# Altium schematic sheet SOM_Console.SchDoc
size 420 x 297 mm; SheetNumber: 9; SheetTotal: 21
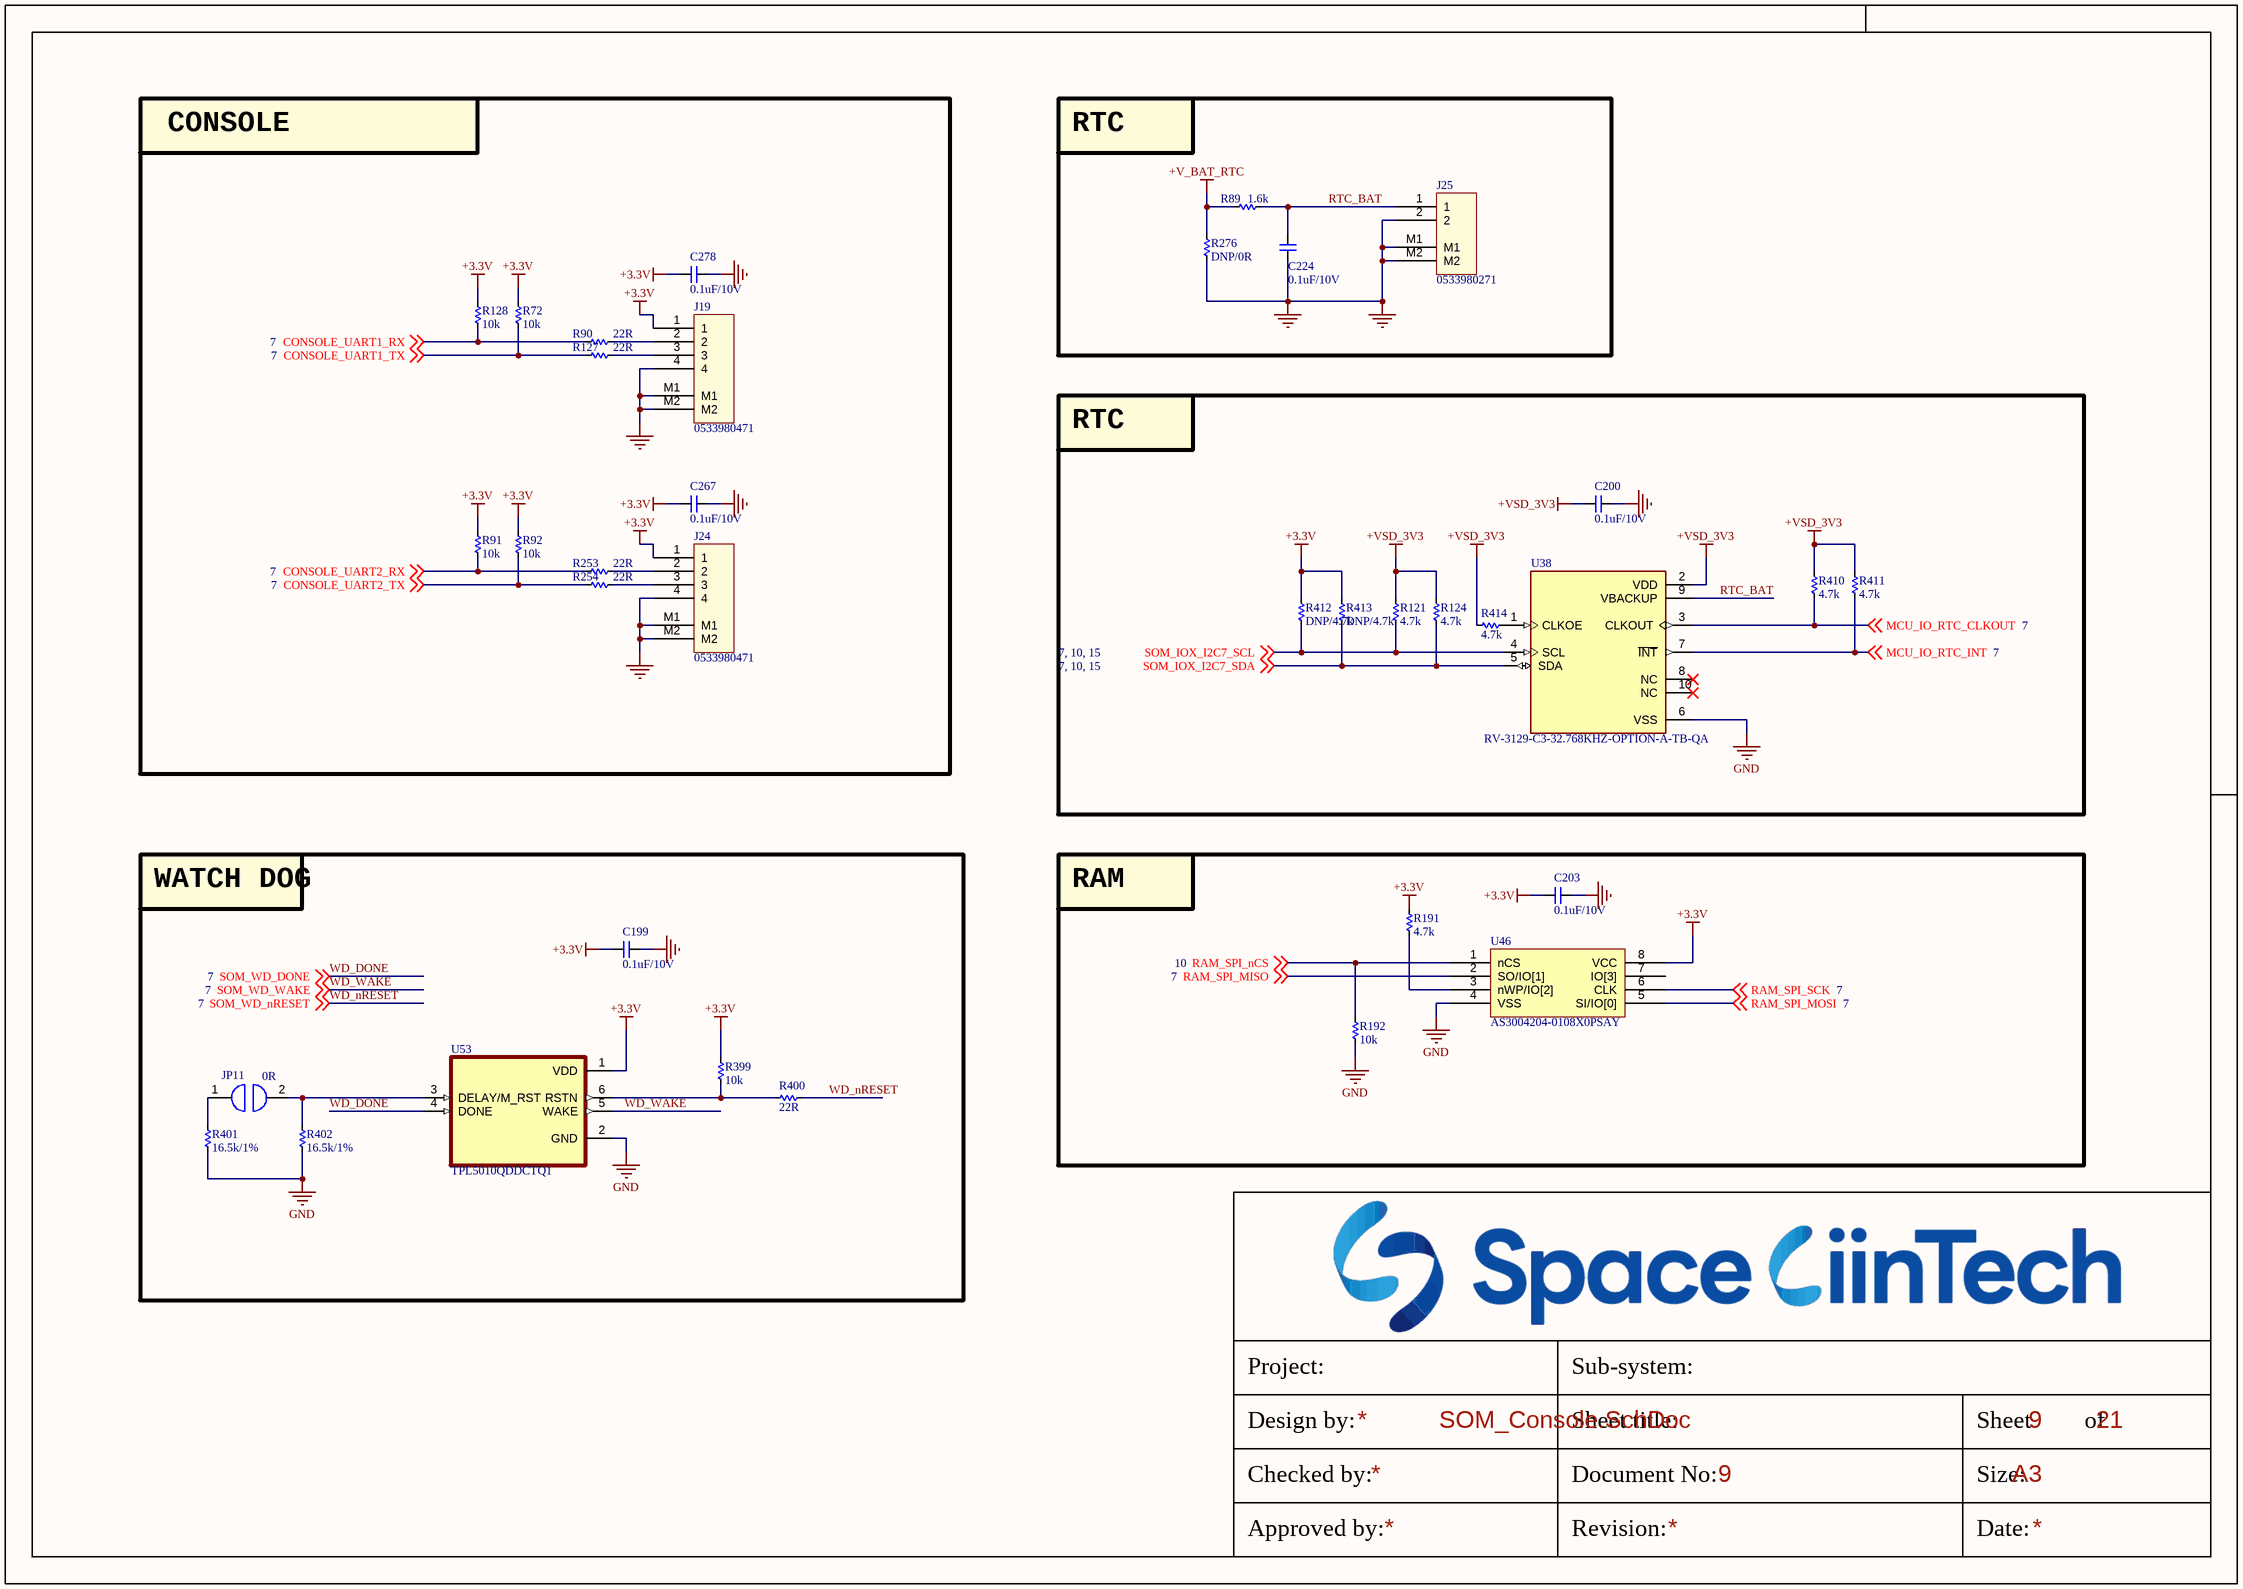
[diagram p0: SOM_Console.SchDoc]

## Parts
C199  0.1uF/10V  [CAP_C_1005X60]
C200  0.1uF/10V  [CAP_C_1005X60]
C203  0.1uF/10V  [CAP_C_1005X60]
C224  0.1uF/10V  [CAP_C_1005X60]
C267  0.1uF/10V  [CAP_C_1005X60]
C278  0.1uF/10V  [CAP_C_1005X60]
J19  0533980471  [MOLEX_0533980471]
J24  0533980471  [MOLEX_0533980471]
J25  0533980271  [MOLEX_0533980271]
JP11  0R  [RES_C_1608X60]
R72  10k  [RES_C_1005X40]
R89  1.6k  [RES_C_1005X40]
R90  22R  [RES_C_1005X40]
R91  10k  [RES_C_1005X40]
R92  10k  [RES_C_1005X40]
R121  4.7k  [RES_C_1005X40]
R124  4.7k  [RES_C_1005X40]
R127  22R  [RES_C_1005X40]
R128  10k  [RES_C_1005X40]
R191  4.7k  [RES_C_1005X40]
R192  10k  [RES_C_1005X40]
R253  22R  [RES_C_1005X40]
R254  22R  [RES_C_1005X40]
R276  DNP/0R  [RES_C_1005X40]
R399  10k  [RES_C_1005X40]
R400  22R  [RES_C_1005X40]
R401  16.5k/1%  [RES_C_1005X40]
R402  16.5k/1%  [RES_C_1005X40]
R410  4.7k  [RES_C_1005X40]
R411  4.7k  [RES_C_1005X40]
R412  DNP/4.7k  [RES_C_1005X40]
R413  DNP/4.7k  [RES_C_1005X40]
R414  4.7k  [RES_C_1005X40]
U38  RV-3129-C3-32.768KHZ-OPTION-A-TB-QA  [IC_RV-3129-C3_32.768KHZ_OPTION_A_TB_QA]
U46  AS3004204-0108X0PSAY  [SOIC127P790X216-8]
U53  TPL5010QDDCTQ1  [SOT95P280X145-6N]

## Blocks framed on the sheet
CONSOLE: C267 C278 J19 J24 R72 R90-R92 R127 R128 R253 R254
RTC: C224 J25 R89 R276
RTC: C200 R121 R124 R410-R414 U38
WATCH DOG: C199 JP11 R399-R402 U53
RAM: C203 R191 R192 U46

## Nets
+3.3V: C199.2 C203.2 C267.2 C278.2 J19.1 J24.1 R72.2 R91.2 R92.2 R128.2 R191.2 R399.2 R412.2 R413.2 U46.8(VCC) U53.1(VDD)
+V_BAT_RTC: R89.1 R276.1
+VSD_3V3: C200.2 R121.2 R124.2 R410.2 R411.2 R414.2 U38.2(VDD)
GND: C199.1 C200.1 C203.1 C224.1 C267.1 C278.1 J19.4 J19.M1 J19.M2 J24.4 J24.M1 J24.M2 J25.2 J25.M1 J25.M2 R192.1 R276.2 R401.1 R402.1 U38.6(VSS) U46.4(VSS) U53.2(GND)
CONSOLE_UART1_RX: R90.2 R128.1 ; off-sheet CONSOLE_UART1_RX
CONSOLE_UART1_TX: R72.1 R127.2 ; off-sheet CONSOLE_UART1_TX
CONSOLE_UART2_RX: R91.1 R253.2 ; off-sheet CONSOLE_UART2_RX
CONSOLE_UART2_TX: R92.1 R254.2 ; off-sheet CONSOLE_UART2_TX
MCU_IO_RTC_CLKOUT: R410.1 U38.3(CLKOUT) ; off-sheet MCU_IO_RTC_CLKOUT
MCU_IO_RTC_INT: R411.1 U38.7(~{INT}) ; off-sheet MCU_IO_RTC_INT
RAM_SPI_MISO: U46.2(SO/IO[1]) ; off-sheet RAM_SPI_MISO
RAM_SPI_MOSI: U46.5(SI/IO[0]) ; off-sheet RAM_SPI_MOSI
RAM_SPI_nCS: R192.2 U46.1(nCS) ; off-sheet RAM_SPI_nCS
RAM_SPI_SCK: U46.6(CLK) ; off-sheet RAM_SPI_SCK
RTC_BAT: C224.2 J25.1 R89.2 U38.9(VBACKUP)
SOM_IOX_I2C7_SCL: R121.1 R412.1 U38.4(SCL) ; off-sheet SOM_IOX_I2C7_SCL
SOM_IOX_I2C7_SDA: R124.1 R413.1 U38.5(SDA) ; off-sheet SOM_IOX_I2C7_SDA
WD_DONE: U53.4(DONE) ; off-sheet SOM_WD_DONE  [also labelled SOM_WD_DONE]
WD_nRESET: R400.1 ; off-sheet SOM_WD_nRESET  [also labelled SOM_WD_nRESET]
WD_WAKE: U53.5(WAKE) ; off-sheet SOM_WD_WAKE  [also labelled SOM_WD_WAKE]
NetJ19_2: J19.2 R90.1
NetJ19_3: J19.3 R127.1
NetJ24_2: J24.2 R253.1
NetJ24_3: J24.3 R254.1
NetJP11_1: JP11.1 R401.2
NetJP11_2: JP11.2 R402.2 U53.3(DELAY/M_RST)
NetR191_1: R191.1 U46.3(nWP/IO[2])
NetR399_1: R399.1 R400.2 U53.6(RSTN)
NetR414_1: R414.1 U38.1(CLKOE)

Not connected (* = marked no-connect by the designer): U38 8(NC)* 10(NC)*; U46 7(IO[3])

## Notes on the sheet
- Project:
- Sub-system:
- Design by:
- Sheet title:
- Sheet
- of
- Checked by:
- Approved by:
- Revision:
- Document No:
- Size:
- Date:
- A3

## Library data of the parts
C199 C200 C203 C224 C267 C278 = _CAP_C_2: CAP CHIP
J19 J24 = Header 4x1_2M
J25 = Header 2x1_2M
JP11 = JUMPER
R72 R89-R92 R121 R124 R127 R128 R191 R192 R253 R254 R276 R399-R402 R410-R414 = _RES_B_2: RES
U38 = RV-3129-C3_32.768KHZ_OPTION_A_TB_QA: Real-Time Clock Module, Temperature compensated, in 2.5 x 3.7 mm package; MF: Micro Crystal; MP: RV-3129-C3 32.768KHZ OPTION A TB QA; SnapEDA_Link: https://www.snapeda.com/parts/RV-3129-C3%2032.768KHZ%20OPTION%20A%20TB%20QA/Micro+Crystal/view-part/?ref=snap; Package: QFN-10 Micro Crystal; Value: *; Check_prices: https://www.snapeda.com/parts/RV-3129-C3%2032.768KHZ%20OPTION%20A%20TB%20QA/Micro+Crystal/view-part/?ref=eda
U46 = IC_RAM_AS3004204-0108X0PSAY
U53 = TPL5010QDDCTQ1: Package: None; Price: None; Value: *; MP: TPL5010QDDCTQ1; Availability: Unavailable